# EAGLE schematic Escudo_cruz (EAGLE 9.4.2)
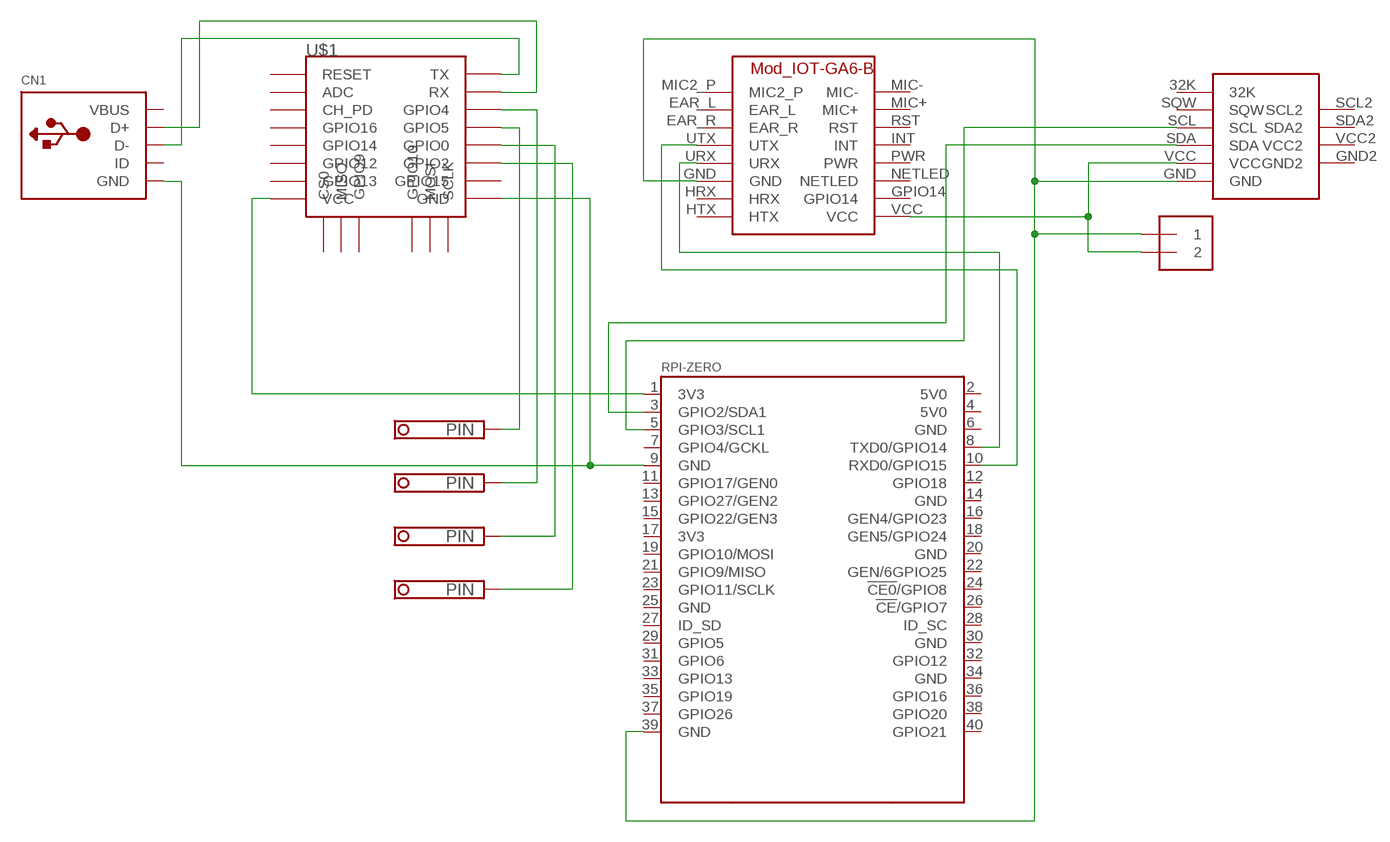
[diagram p0: schematic, sheet 1]

## Parts
CN1  USBMINIB  [USB-MINIB]
J1  1X2-3.5MM  [1X2-3.5MM]
U$1  ESP12Q  [ESP12Q]
U$2  RPI-ZERO  [RASPBERRYPI_BASTELSTUBE_V13_RASPI_BOARD_B+_FULL]
U$3  IOT-GA6-B  [IOT-GA6-B]
U$4  RTC_DS3231  [RTC_DS3231]
X1  TERMINAL-BLOCK-3.5MM-4-PIN-ROUND-PAD  [TERMINAL-BLOCK-4-PIN-3.5MM-ROUND-PAD]

## Nets
3V3@1: U$1.VCC U$2.1(3V3)
GND@1: CN1.GND U$1.GND U$2.9(GND)
GND@3: J1.1 U$2.39(GND) U$3.GND U$4.GND
N$1: J1.2 U$3.VCC U$4.VCC
N$2: U$2.8(TXD0/GPIO14) U$3.URX
N$3: U$2.3(GPIO2/SDA1) U$4.SDA
N$4: U$2.5(GPIO3/SCL1) U$4.SCL
N$5: U$2.10(RXD0/GPIO15) U$3.UTX
N$6: U$1.GPIO5 X1.1
N$7: U$1.GPIO4 X1.2
N$8: U$1.GPIO0 X1.3
N$9: U$1.GPIO2 X1.4
N$10: CN1.D- U$1.TX
N$11: CN1.D+ U$1.RX
Unconnected: CN1.ID U$1.ADC U$1.CH_PD U$1.CS0 U$1.GPIO9 U$1.GPIO10 U$1.GPIO12 U$1.GPIO13 U$1.GPIO14 U$1.GPIO15 U$1.GPIO16 U$1.MISO U$1.MOSI U$1.RESET U$1.SCLK U$2.2(5V0) U$2.4(5V0) U$2.6(GND) U$2.7(GPIO4/GCKL) U$2.11(GPIO17/GEN0) U$2.12(GPIO18) U$2.13(GPIO27/GEN2) U$2.14(GND) U$2.15(GPIO22/GEN3) U$2.16(GEN4/GPIO23) U$2.17(3V3) U$2.18(GEN5/GPIO24) U$2.19(GPIO10/MOSI) U$2.20(GND) U$2.21(GPIO9/MISO) U$2.22(GEN/6GPIO25) U$2.23(GPIO11/SCLK) U$2.24(!CE0!/GPIO8) U$2.25(GND) U$2.26(!CE!/GPIO7) U$2.27(ID_SD) U$2.28(ID_SC) U$2.29(GPIO5) U$2.30(GND) U$2.31(GPIO6) U$2.32(GPIO12) U$2.33(GPIO13) U$2.34(GND) U$2.35(GPIO19) U$2.36(GPIO16) U$2.37(GPIO26) U$2.38(GPIO20) U$2.40(GPIO21) U$3.EAR_L U$3.EAR_R U$3.GPIO14 U$3.HRX U$3.HTX U$3.INT U$3.MIC2_P U$3.MIC+ U$3.MIC- U$3.NETLED U$3.PWR U$3.RST U$4.32K U$4.GND2 U$4.SCL2 U$4.SDA2 U$4.SQW U$4.VCC2

## Power pins joined to a net without a drawn wire
VBUS: CN1.VBUS

## Library data of the parts
CN1 = adafruit:USB: USB Connectors USBMINIB - Surface Mount Female Mini-B USB Connector 4UConnector: 06564 By microbuilder.eu Thru-hole RA Female Mini-B USB Connector 4UConnector: 18732 By ladyada.net
J1 = adafruit:1X2: 3.5mm Terminal block http://www.ladyada.net/library/pcb/eaglelibrary.html
U$1 = esp826612q:ESP12Q: ESP8266 Wifi module 12-Q
U$2 = RASPBERRY_PI-Zero:RPI-ZERO
U$3 = IOT-GA6-B:IOT-GA6-B
U$4 = RTC_DS3231:RTC_DS3231
X1 = Rembrandt Electronics - Terminal Block 3-5mm v1-0:TERMINAL-BLOCK-3.5MM-4-PIN: Terminal Block 3.5mm Pitch: 3,5 mm Number of pins: 4 Created by Rembrandt Electronics www.rembrandtelectronics.com